# Altium schematic sheet Sheet1.SchDoc
size E; SheetNumber: 1; SheetTotal: 1
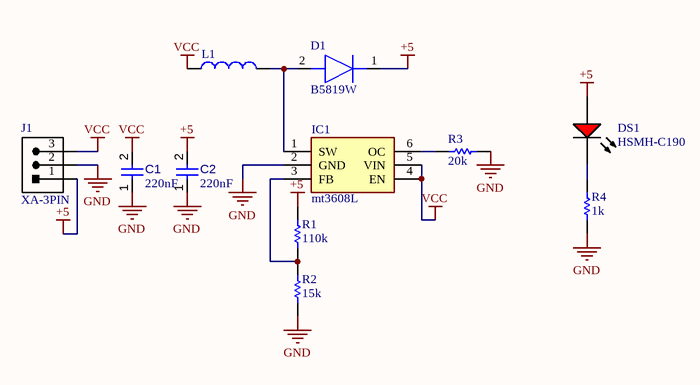
[diagram p0: Sheet1.SchDoc]

## Parts
C1  value 220nF  [CAPC0805(2012)145_L]  (hidden comment: C0805C224K5RACTU)
C2  value 220nF  [CAPC0805(2012)145_L]  (hidden comment: C0805C224K5RACTU)
D1  B5819W  [SOD3716X125N]
DS1  HSMH-C190  [AVAG-HSMX-C190_V]
IC1  mt3608L  [SOT95P280X145-6N]
J1  XA-3PIN  [XA-3PIN-Footprint-1]
L1  MBKK2012T4R7M  [INDC2520X120X60LL20T20]  (value not drawn)
R1  value 110k  [RESC0402(1005)_L]  (hidden comment: ERJ-1GNF1103C)
R2  value 15k  [RESC0603(1608)_L]  (hidden comment: ERA-3AEB153V)
R3  value 20k  [RESC1608X55X30LL15T15]  (hidden comment: ERJ-3EKF2002V)
R4  value 1k  [RESC0603(1608)_L]  (hidden comment: RMCF0603FT1K00)

## Nets
+5: C2.2 D1.1(K) DS1.1(A) J1.1 R1.2
GND: C1.1 C2.1 IC1.2(GND) J1.2 R2.2 R3.2 R4.2
VCC: C1.2 IC1.4(EN) IC1.5(VIN) J1.3 L1.1
NetD1_2: D1.2(A) IC1.1(SW) L1.2
NetDS1_2: DS1.2(K) R4.1
NetIC1_3: IC1.3(FB) R1.1 R2.1
NetIC1_6: IC1.6(OC) R3.1

## Library data of the parts
C1 C2 = CMP-001-00147-1: Ceramic Capacitor, Multilayer, Ceramic, 50V, 10% +Tol, 10% -Tol, X7R, 15% TC, 0.22uF, Surface Mount, 0805; Pins: 2; Min Operating Temperature: -55°C; Max Operating Temperature: 125°C; Capacitor Type: Ceramic; Mounting Technology: Surface Mount; RoHS Compliant: Yes; Case/Package: 0805
D1 = B5819W: Diode; Manufacturer_Name: Changjiang Electronics Tech (CJ); Datasheet Link: https://datasheet.lcsc.com/szlcsc/Changjiang-Electronics-Tech-CJ-B5819W_C8598.pdf; Height: 1.25mm; Manufacturer_Part_Number: B5819W
DS1 = CMP-007-00014-2: LED Uni-Color Red, 65 mW, 20 mA, -40 to 85 degC, 2-Pin SMD, RoHS, Tape and Reel; Manufacturer: Avago; Nominal Vf: 1.8V; Luminous Intensity: 17mcd; Power: 78mW; Forward Current: 20mA; Lens Style: Diffused; Viewing Angle: 170degrees; Package Quantity: 4000; Colour: Red; Manufacturer URL: http://www.avagotech.com/; Min Operating Temperature: -40°C; Datasheet URL: http://docs.avagotech.com/docs/AV02-0551EN; RoHS Compliant: True; Forward Voltage: 1.8V; Pins: 2; Max Operating Temperature: 85°C; Packaging: TapeandReel; Package Reference: HSMX-C190; Datasheet Version: Mar-12; Package Description: 2-Pin Surface Mount Device, Body 1.6 x 0.8 mm, Height 0.9 mm; Case/Package: 0603; Mounting Technology: SM; Illumination Colour: Red
IC1 = mt3608L: Integrated Circuit; Manufacturer_Name: Aerosemi; Datasheet Link: https://datasheet.lcsc.com/lcsc/2201121530_XI-AN-Aerosemi-Tech-MT3608L_C2932326.pdf; Height: 1.45mm; Manufacturer_Part_Number: mt3608L
J1 = CMP-002-00073-4: 3 pin JST Connector
L1 = CMP-006-00022-1: General Purpose Inductor, 4.7uH, 20%, 1 Element, Metal-Core, SMD, 0805; Max Current Rating: 600mA; RoHS Compliant: Yes; Min Operating Temperature: -40°C; Tolerance: 20%; Max Operating Temperature: 105°C
R1 = CMP-009-00289-1: Fixed Resistor, Metal Glaze/thick Film, 0.05W, 110000ohm, 25V, 1% +/-Tol, 200ppm/Cel, Surface Mount, 0201; Power: 50mW; Max Operating Temperature: 125°C; RoHS Compliant: Yes; Case/Package: 0201; Min Operating Temperature: -55°C; Tolerance: 1%; Pins: 2; Mounting Technology: Surface Mount
R2 = CMP-009-00220-2: Fixed Resistor, Thin Film, 0.1W, 15000ohm, 75V, 0.1% +/-Tol, 25ppm/Cel, Surface Mount, 0603; Power: 100mW; Tolerance: 0.1%; Case/Package: 0603; RoHS Compliant: Yes; Pins: 2; Max Operating Temperature: 155°C; Mounting Technology: Surface Mount; Min Operating Temperature: -55°C
R3 = CMP-009-00211-1: Fixed Resistor, Metal Glaze/thick Film, 0.1W, 20000ohm, 75V, 1% +/-Tol, 100ppm/Cel, Surface Mount, 0603; Power: 100mW; Case/Package: 0603; Tolerance: 1%; Max Operating Temperature: 155°C; Pins: 2; RoHS Compliant: Yes; Min Operating Temperature: -55°C; Mounting Technology: Surface Mount
R4 = CMP-009-00263-1: Fixed Resistor, Metal Glaze/thick Film, 0.1W, 1000ohm, 75V, 1% +/-Tol, 100ppm/Cel, Surface Mount, 0603; Power: 100mW; Tolerance: 1%; Pins: 2; RoHS Compliant: Yes; Max Operating Temperature: 155°C; Case/Package: 0603; Mounting Technology: Surface Mount; Min Operating Temperature: -55°C